# EAGLE design open-race-scale-pi-zero-board-v.01 (EAGLE 8.2.2)
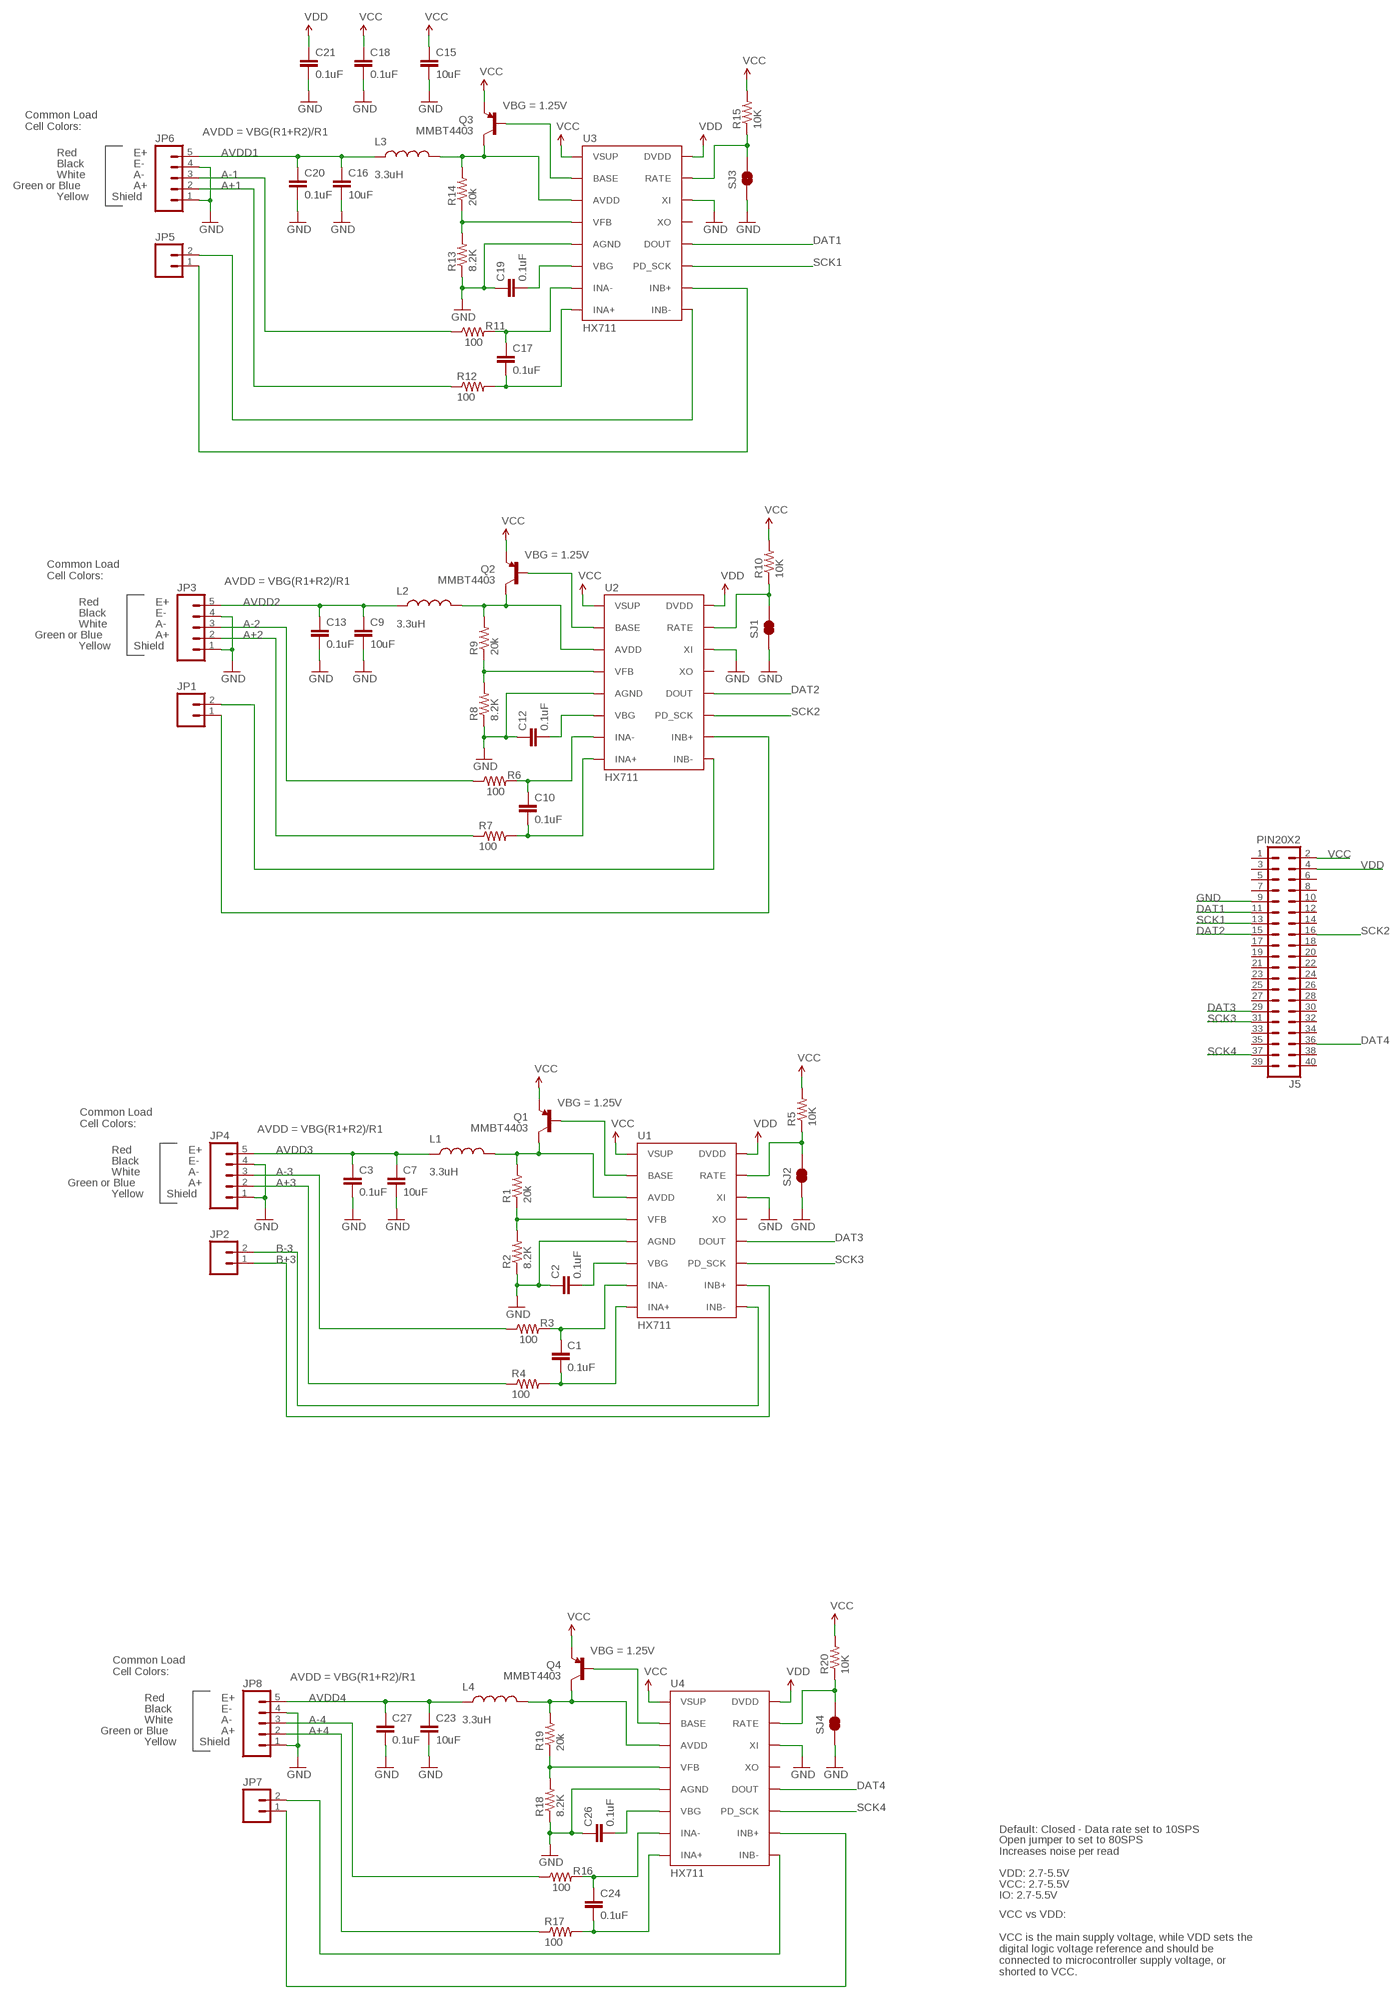
[diagram p0: schematic, sheet 1]

## Parts
C1  0.1uF  0.1UF-25V-5%(0603)  [0603-CAP]
C2  0.1uF  0.1UF-25V-5%(0603)  [0603-CAP]
C3  0.1uF  0.1UF-25V-5%(0603)  [0603-CAP]
C7  10uF  10UF50V20%(1210)  [1210]
C9  10uF  10UF50V20%(1210)  [1210]
C10  0.1uF  0.1UF-25V-5%(0603)  [0603-CAP]
C12  0.1uF  0.1UF-25V-5%(0603)  [0603-CAP]
C13  0.1uF  0.1UF-25V-5%(0603)  [0603-CAP]
C15  10uF  10UF50V20%(1210)  [1210]
C16  10uF  10UF50V20%(1210)  [1210]
C17  0.1uF  0.1UF-25V-5%(0603)  [0603-CAP]
C18  0.1uF  0.1UF-25V-5%(0603)  [0603-CAP]
C19  0.1uF  0.1UF-25V-5%(0603)  [0603-CAP]
C20  0.1uF  0.1UF-25V-5%(0603)  [0603-CAP]
C21  0.1uF  0.1UF-25V-5%(0603)  [0603-CAP]
C23  10uF  10UF50V20%(1210)  [1210]
C24  0.1uF  0.1UF-25V-5%(0603)  [0603-CAP]
C26  0.1uF  0.1UF-25V-5%(0603)  [0603-CAP]
C27  0.1uF  0.1UF-25V-5%(0603)  [0603-CAP]
J5  PIN20X2  [PIN_20X2]
JP1  M02PTH  [1X02]
JP2  M02PTH  [1X02]
JP3  M05PTH  [1X05]
JP4  M05PTH  [1X05]
JP5  M02PTH  [1X02]
JP6  M05PTH  [1X05]
JP7  M02PTH  [1X02]
JP8  M05PTH  [1X05]
L1  3.3uH  INDUCTOR0805-IND  [0805]
L2  3.3uH  INDUCTOR0805-IND  [0805]
L3  3.3uH  INDUCTOR0805-IND  [0805]
L4  3.3uH  INDUCTOR0805-IND  [0805]
Q1  MMBT4403  TRANSISTOR_PNPMMBT4403  [SOT23-3]
Q2  MMBT4403  TRANSISTOR_PNPMMBT4403  [SOT23-3]
Q3  MMBT4403  TRANSISTOR_PNPMMBT4403  [SOT23-3]
Q4  MMBT4403  TRANSISTOR_PNPMMBT4403  [SOT23-3]
R1  20k  20KOHM1/10W1%(0603)  [0603-RES]
R2  8.2K  8.2KOHM-1/10W-5%(0603)  [0603-RES]
R3  100  100OHM-1/10W-1%(0603)  [0603-RES]
R4  100  100OHM-1/10W-1%(0603)  [0603-RES]
R5  10K  10KOHM-1/10W-1%(0603)0603  [0603-RES]
R6  100  100OHM-1/10W-1%(0603)  [0603-RES]
R7  100  100OHM-1/10W-1%(0603)  [0603-RES]
R8  8.2K  8.2KOHM-1/10W-5%(0603)  [0603-RES]
R9  20k  20KOHM1/10W1%(0603)  [0603-RES]
R10  10K  10KOHM-1/10W-1%(0603)0603  [0603-RES]
R11  100  100OHM-1/10W-1%(0603)  [0603-RES]
R12  100  100OHM-1/10W-1%(0603)  [0603-RES]
R13  8.2K  8.2KOHM-1/10W-5%(0603)  [0603-RES]
R14  20k  20KOHM1/10W1%(0603)  [0603-RES]
R15  10K  10KOHM-1/10W-1%(0603)0603  [0603-RES]
R16  100  100OHM-1/10W-1%(0603)  [0603-RES]
R17  100  100OHM-1/10W-1%(0603)  [0603-RES]
R18  8.2K  8.2KOHM-1/10W-5%(0603)  [0603-RES]
R19  20k  20KOHM1/10W1%(0603)  [0603-RES]
R20  10K  10KOHM-1/10W-1%(0603)0603  [0603-RES]
SJ1  JUMPER-PAD-2-NC_BY_TRACE  [PAD-JUMPER-2-NC_BY_TRACE_YES_SILK]
SJ2  JUMPER-PAD-2-NC_BY_TRACE  [PAD-JUMPER-2-NC_BY_TRACE_YES_SILK]
SJ3  JUMPER-PAD-2-NC_BY_TRACE  [PAD-JUMPER-2-NC_BY_TRACE_YES_SILK]
SJ4  JUMPER-PAD-2-NC_BY_TRACE  [PAD-JUMPER-2-NC_BY_TRACE_YES_SILK]
U1  HX711  HX711HX711  [SO16]
U2  HX711  HX711HX711  [SO16]
U3  HX711  HX711HX711  [SO16]
U4  HX711  HX711HX711  [SO16]

## Nets
A+1: JP6.2 R12.1
A+2: JP3.2 R7.1
A+3: JP4.2 R4.1
A+4: JP8.2 R17.1
A-1: JP6.3 R11.1
A-2: JP3.3 R6.1
A-3: JP4.3 R3.1
A-4: JP8.3 R16.1
AVDD1: C16.1 C20.1 JP6.5 L3.1
AVDD2: C9.1 C13.1 JP3.5 L2.1
AVDD3: C3.1 C7.1 JP4.5 L1.1
AVDD4: C23.1 C27.1 JP8.5 L4.1
B+3: JP2.1 U1.10(INB+)
B-3: JP2.2 U1.9(INB-)
DAT1: J5.11 U3.12(DOUT)
DAT2: J5.15 U2.12(DOUT)
DAT3: J5.29 U1.12(DOUT)
DAT4: J5.36 U4.12(DOUT)
GND: C2.1 C3.2 C7.2 C9.2 C12.1 C13.2 C15.2 C16.2 C18.2 C19.1 C20.2 C21.2 C23.2 C26.1 C27.2 J5.9 JP3.1 JP3.4 JP4.1 JP4.4 JP6.1 JP6.4 JP8.1 JP8.4 R2.1 R8.1 R13.1 R18.1 SJ1.1 SJ2.1 SJ3.1 SJ4.1 U1.5(AGND) U1.14(XI) U2.5(AGND) U2.14(XI) U3.5(AGND) U3.14(XI) U4.5(AGND) U4.14(XI)
N$1: R5.1 SJ2.2 U1.15(RATE)
N$2: C1.1 R3.2 U1.7(INA-)
N$3: C1.2 R4.2 U1.8(INA+)
N$4: Q1.1(B) U1.2(BASE)
N$5: L1.2 Q1.3(C) R1.2 U1.3(AVDD)
N$6: R1.1 R2.2 U1.4(VFB)
N$7: C2.2 U1.6(VBG)
N$8: JP7.1 U4.10(INB+)
N$9: R8.2 R9.1 U2.4(VFB)
N$10: C12.2 U2.6(VBG)
N$11: JP5.1 U3.10(INB+)
N$12: JP5.2 U3.9(INB-)
N$13: JP7.2 U4.9(INB-)
N$14: JP1.1 U2.10(INB+)
N$15: JP1.2 U2.9(INB-)
N$20: C17.1 R11.2 U3.7(INA-)
N$21: C17.2 R12.2 U3.8(INA+)
N$22: Q4.1(B) U4.2(BASE)
N$23: R18.2 R19.1 U4.4(VFB)
N$24: C26.2 U4.6(VBG)
N$25: L4.2 Q4.3(C) R19.2 U4.3(AVDD)
N$26: R20.1 SJ4.2 U4.15(RATE)
N$27: C24.1 R16.2 U4.7(INA-)
N$28: C24.2 R17.2 U4.8(INA+)
N$82: Q2.1(B) U2.2(BASE)
N$112: L2.2 Q2.3(C) R9.2 U2.3(AVDD)
N$122: R10.1 SJ1.2 U2.15(RATE)
N$132: C10.1 R6.2 U2.7(INA-)
N$142: C10.2 R7.2 U2.8(INA+)
N$151: Q3.1(B) U3.2(BASE)
N$161: R13.2 R14.1 U3.4(VFB)
N$171: C19.2 U3.6(VBG)
N$182: L3.2 Q3.3(C) R14.2 U3.3(AVDD)
N$191: R15.1 SJ3.2 U3.15(RATE)
SCK1: J5.13 U3.11(PD_SCK)
SCK2: J5.16 U2.11(PD_SCK)
SCK3: J5.31 U1.11(PD_SCK)
SCK4: J5.37 U4.11(PD_SCK)
VCC: C15.1 C18.1 J5.2 Q1.2(E) Q2.2(E) Q3.2(E) Q4.2(E) R5.2 R10.2 R15.2 R20.2 U1.1(VSUP) U2.1(VSUP) U3.1(VSUP) U4.1(VSUP)
VDD: C21.1 J5.4 U1.16(DVDD) U2.16(DVDD) U3.16(DVDD) U4.16(DVDD)
Unconnected: J5.1 J5.3 J5.5 J5.6 J5.7 J5.8 J5.10 J5.12 J5.14 J5.17 J5.18 J5.19 J5.20 J5.21 J5.22 J5.23 J5.24 J5.25 J5.26 J5.27 J5.28 J5.30 J5.32 J5.33 J5.34 J5.35 J5.38 J5.39 J5.40 U1.13(XO) U2.13(XO) U3.13(XO) U4.13(XO)

## Notes on the sheet
- VBG = 1.25V
- Common Load
  Cell Colors:
- AVDD = VBG(R1+R2)/R1
- Red | E+
- Black | E-
- White | A-
- Green or Blue | A+
- Yellow | Shield
- VBG = 1.25V
- Common Load
  Cell Colors:
- AVDD = VBG(R1+R2)/R1
- Red | E+
- Black | E-
- White | A-
- Green or Blue | A+
- Yellow | Shield
- VBG = 1.25V
- Common Load
  Cell Colors:
- AVDD = VBG(R1+R2)/R1
- Red | E+
- Black | E-
- White | A-
- Green or Blue | A+
- Yellow | Shield
- VBG = 1.25V
- Common Load
  Cell Colors:
- AVDD = VBG(R1+R2)/R1
- Red | E+
- Black | E-
- White | A-
- Green or Blue | A+
- Yellow | Shield
- Default: Closed - Data rate set to 10SPS
- Open jumper to set to 80SPS
  Increases noise per read
- VDD: 2.7-5.5V
- VCC: 2.7-5.5V
- IO: 2.7-5.5V
- VCC vs VDD:
  
  VCC is the main supply voltage, while VDD sets the
  digital logic voltage reference and should be
  connected to microcontroller supply voltage, or
  shorted to VCC.

## Library data of the parts
C1-C3 C10 C12 C13 C17-C21 C24 C26 C27 = SparkFun-Capacitors:0.1UF-25V-5%(0603): CAP-08604; PROD_ID: CAP-08604
C7 C9 C15 C16 C23 = SparkFun-Capacitors:10UF50V20%(1210): CAP-09824; PROD_ID: CAP-09824
J5 = FLYFISH:PIN20X2
JP1 JP2 JP5 JP7 = SparkFun-Connectors:M02: Standard 2-pin 0.1" header. Use with - straight break away headers ( PRT-00116) - right angle break away headers (PRT-00553) - swiss pins (PRT-00743) - machine pins (PRT-00117) - female headers (PRT-00115) Molex polarized connector foot print use with: PRT-08233 with associated crimp pins and housings. 2.54_SCREWTERM for use with PRT-10571. 3.5mm Screw Terminal footprints for PRT-08084 5mm Screw Terminal footprints for use with PRT-08432
JP3 JP4 JP6 JP8 = SparkFun-Connectors:M05: Header 5 Standard 5-pin 0.1" header. Use with straight break away headers (SKU : PRT-00116), right angle break away headers (PRT-00553), swiss pins (PRT-00743), machine pins (PRT-00117), and female headers (PRT-00115). Molex polarized connector foot print use with SKU : PRT-08230 with associated crimp pins and housings.
L1-L4 = SparkFun-Passives:INDUCTOR: Inductors Basic Inductor/Choke - 0603 and 1206. Footprints are not proven and vary greatly between part numbers. INDUCTOR POWER 3.3UH 4.0A SMD 0.197" L x 0.197" W x 0.177" H (5.00mm x 5.00mm x 4.50mm); PROD_ID: NDUC-13076
Q1-Q4 = SparkFun-DiscreteSemi:TRANSISTOR_PNP: Generic PNP BJT Double check pinouts against datasheets- not all devices are the same! MMBT3906 - 40V 200mA SOT-23 (TRANS-08052) MMBT4403 - 40V 600mA SOT-23 (TRANS-09245); PROD_ID: TRANS-09245
R1 R9 R14 R19 = SparkFun-Resistors:20KOHM1/10W1%(0603): RES-09383; PROD_ID: RES-09383
R2 R8 R13 R18 = SparkFun-Resistors:8.2KOHM-1/10W-5%(0603): RES-10646; PROD_ID: RES-10646
R3 R4 R6 R7 R11 R12 R16 R17 = SparkFun-Resistors:100OHM-1/10W-1%(0603): RES-07863; PROD_ID: RES-07863
R5 R10 R15 R20 = SparkFun-Resistors:10KOHM-1/10W-1%(0603): RES-00824; PROD_ID: RES-00824
SJ1-SJ4 = SparkFun-Passives:JUMPER-PAD-2-NC_BY_TRACE
U1-U4 = Testing:HX711; PROD_ID: IC-12445

## Board
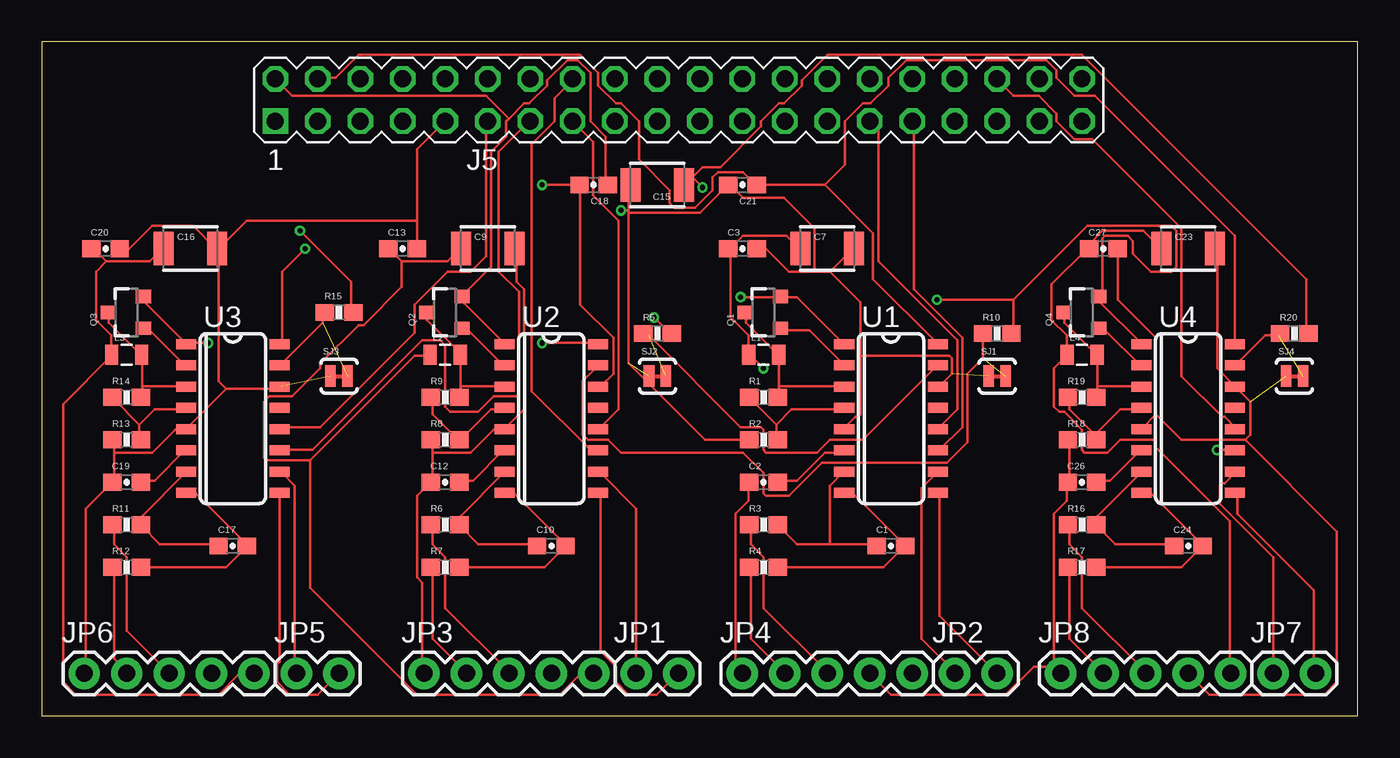
[diagram p1: board, top side]
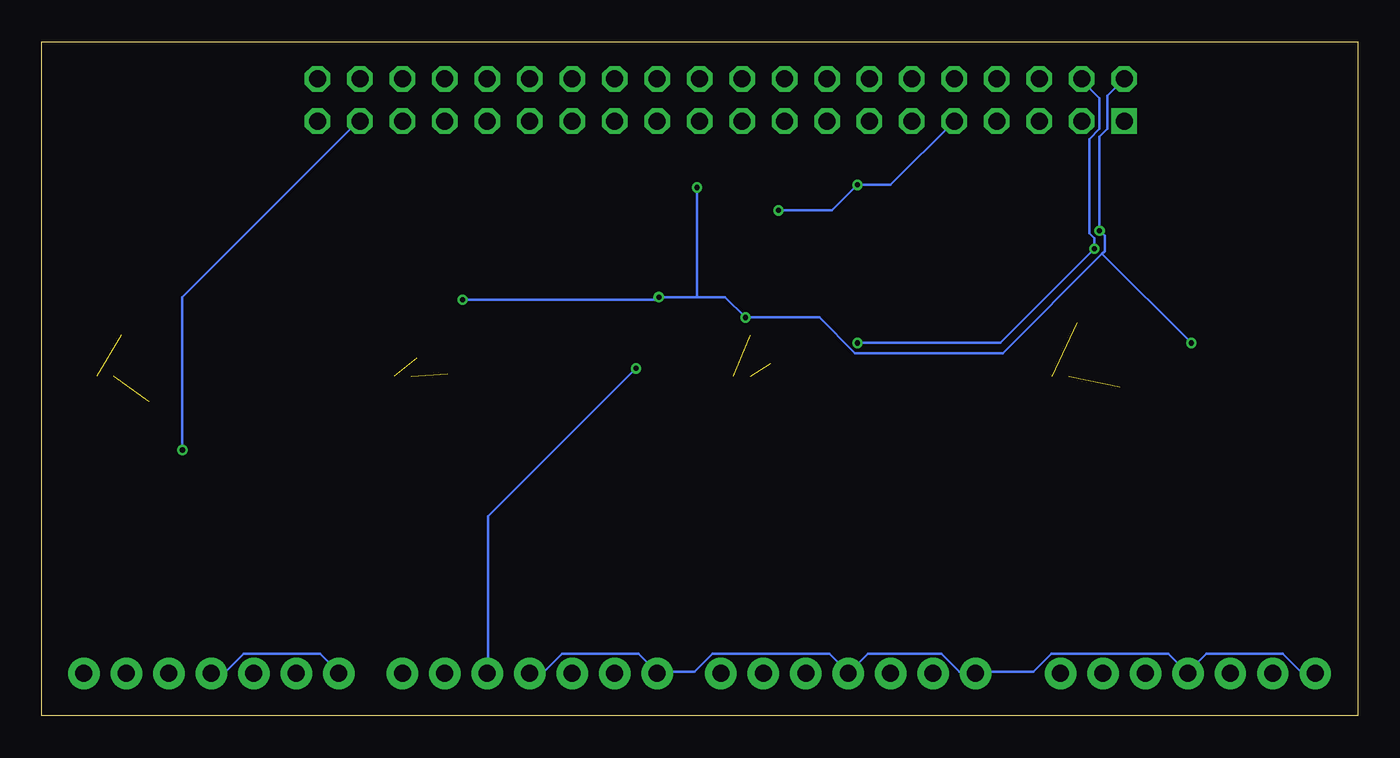
[diagram p2: board, bottom side, seen from below]

Size 78.72 x 40.31 mm. Coordinates in mm from the lower left corner, seen from the top.
Outline: 0,0 78.72,0 78.72,40.31 0,40.31 0,0
Copper layers (1*16): Top 0.035mm / dielectric 1.5mm / Bottom 0.035mm
Design rules "SeeedStudio_2layer_DRU_no_angle_20140221": minimum track width 6mil, minimum drill 12mil, track to track 6mil, track to pad 6mil, pad to pad 6mil, via to via 6mil, smd to smd 0mil, copper to edge 10mil, drill to drill 10mil, minimum pad ring 10mil, minimum via ring 6mil, stop-mask expansion 2mil, vias tented up to drill 100mil, thermal gap 10mil

### Footprints (pad centres in the part's own frame; a part is rotated, then mirrored left to right if it is on the bottom)
0603-CAP = smd 1.1 x 1: 1 -0.85,0; 2 0.85,0
1210 = smd 1.2 x 2: 1 -1.6,0; 2 1.6,0
PIN_20X2 = drill 1.016 square: 1 -24.13,-1.27 | drill 1.016 octagon: 2 -24.13,1.27; 3 -21.59,-1.27; 4 -21.59,1.27; 5 -19.05,-1.27; 6 -19.05,1.27; 7 -16.51,-1.27; 8 -16.51,1.27; 9 -13.97,-1.27; 10 -13.97,1.27; 11 -11.43,-1.27; 12 -11.43,1.27; 13 -8.89,-1.27; 14 -8.89,1.27; 15 -6.35,-1.27; 16 -6.35,1.27; 17 -3.81,-1.27; 18 -3.81,1.27; 19 -1.27,-1.27; 20 -1.27,1.27; 21 1.27,-1.27; 22 1.27,1.27; 23 3.81,-1.27; 24 3.81,1.27; 25 6.35,-1.27; 26 6.35,1.27; 27 8.89,-1.27; 28 8.89,1.27; 29 11.43,-1.27; 30 11.43,1.27; 31 13.97,-1.27; 32 13.97,1.27; 33 16.51,-1.27; 34 16.51,1.27; 35 19.05,-1.27; 36 19.05,1.27; 37 21.59,-1.27; 38 21.59,1.27; 39 24.13,-1.27; 40 24.13,1.27
1X02 = drill 1.016 pad 1.88: 1 0,0; 2 2.54,0
1X05 = drill 1.016 pad 1.88: 1 0,0; 2 2.54,0; 3 5.08,0; 4 7.62,0; 5 10.16,0
0805 = smd 0.8 x 1.2: 1 -0.9,0; 2 0.9,0
SOT23-3 = smd 0.8 x 0.9: 1 -0.95,-1; 2 0.95,-1; 3 0,1.1
0603-RES = smd 1.1 x 1: 1 -0.85,0; 2 0.85,0
PAD-JUMPER-2-NC_BY_TRACE_YES_SILK = smd 0.635 x 1.27: 1 -0.508,0; 2 0.508,0
SO16 = smd 0.6 x 1.2: 1 -4.445,-2.8; 2 -3.175,-2.8; 3 -1.905,-2.8; 4 -0.635,-2.8; 5 0.635,-2.8; 6 1.905,-2.8; 7 3.175,-2.8; 8 4.445,-2.8; 9 4.445,2.8; 10 3.175,2.8; 11 1.905,2.8; 12 0.635,2.8; 13 -0.635,2.8; 14 -1.905,2.8; 15 -3.175,2.8; 16 -4.445,2.8

### Placement (x,y rotation side)
C1  50.8,10.16 0 top
C2  43.18,13.97 0 top
C3  41.91,27.94 0 top
C7  46.99,27.94 0 top
C9  26.67,27.94 0 top
C10  30.48,10.16 0 top
C12  24.13,13.97 0 top
C13  21.59,27.94 0 top
C15  36.83,31.75 180 top
C16  8.89,27.94 0 top
C17  11.43,10.16 0 top
C18  33.02,31.75 180 top
C19  5.08,13.97 0 top
C20  3.81,27.94 0 top
C21  41.91,31.75 180 top
C23  68.58,27.94 0 top
C24  68.58,10.16 0 top
C26  62.23,13.97 0 top
C27  63.5,27.94 0 top
J5  38.1,36.83 0 top
JP1  35.56,2.54 0 top
JP2  54.61,2.54 0 top
JP3  22.86,2.54 0 top
JP4  41.91,2.54 0 top
JP5  15.24,2.54 0 top
JP6  2.54,2.54 0 top
JP7  73.66,2.54 0 top
JP8  60.96,2.54 0 top
L1  43.18,21.59 0 top
L2  24.13,21.59 0 top
L3  5.08,21.59 0 top
L4  62.23,21.59 0 top
Q1  43.18,24.13 90 top
Q2  24.13,24.13 90 top
Q3  5.08,24.13 90 top
Q4  62.23,24.13 90 top
R1  43.18,19.05 0 top
R2  43.18,16.51 0 top
R3  43.18,11.43 0 top
R4  43.18,8.89 0 top
R5  36.83,22.86 0 top
R6  24.13,11.43 0 top
R7  24.13,8.89 0 top
R8  24.13,16.51 0 top
R9  24.13,19.05 0 top
R10  57.15,22.86 0 top
R11  5.08,11.43 0 top
R12  5.08,8.89 0 top
R13  5.08,16.51 0 top
R14  5.08,19.05 0 top
R15  17.78,24.13 0 top
R16  62.23,11.43 0 top
R17  62.23,8.89 0 top
R18  62.23,16.51 0 top
R19  62.23,19.05 0 top
R20  74.93,22.86 0 top
SJ1  57.15,20.32 0 top
SJ2  36.83,20.32 0 top
SJ3  17.78,20.32 0 top
SJ4  74.93,20.32 0 top
U1  50.8,17.78 270 top
U2  30.48,17.78 270 top
U3  11.43,17.78 270 top
U4  68.58,17.78 270 top

### Tracks (layer width: path | path; a pad name or v marks a point on that pad's centre or on a via)
A+1
  Top 0.152: R12.1 4.32,8.89 4.32,3.4 5.08,2.64 JP6.2
A+2
  Top 0.152: R7.1 23.37,8.89 23.37,4.62 25.35,2.64 JP3.2
A+3
  Top 0.152: R4.1 42.42,8.89 42.42,4.62 44.4,2.64 JP4.2
A+4
  Top 0.152: R17.1 61.47,8.89 61.47,4.62 63.45,2.64 JP8.2
A-1
  Top 0.152: JP6.3 5.08,5.08 5.08,9.5 4.32,10.26 4.32,11.33 R11.1
A-2
  Top 0.152: R6.1 23.37,11.33 23.37,10.26 24.13,9.5 24.13,6.45 27.94,2.64 JP3.3
A-3
  Top 0.152: R3.1 42.42,11.33 42.42,10.26 43.18,9.5 43.18,6.45 46.99,2.64 JP4.3
A-4
  Top 0.152: R16.1 61.47,11.33 61.47,10.26 62.23,9.5 62.23,6.45 66.04,2.64 JP8.3
AVDD1
  Top 0.152: 3.86,27.18 3.1,27.94 C20.1 | 3.86,27.18 6.45,27.18 7.21,27.94 C16.1 | 3.86,27.18 3.25,26.57 3.25,23.67 4.17,22.76 4.17,21.69 L3.1 4.17,21.54 1.27,18.64 1.27,2.03 2.03,1.27 10.57,1.27 11.79,2.49 12.7,2.49 JP6.5
AVDD2
  Top 0.152: 21.54,27.18 20.78,27.94 C13.1 | 21.54,27.18 24.28,27.18 25.04,27.94 C9.1 | 16.05,15.29 22.3,21.54 23.22,21.54 L2.1 | 16.05,15.29 13.46,15.29 13.31,15.44 13.31,18.8 13.61,19.1 14.99,19.1 16.66,20.78 16.66,21.08 18.95,23.37 19.25,23.37 21.54,25.65 21.54,27.18 | 16.05,15.29 16.05,7.67 22.45,1.27 30.99,1.27 32.21,2.49 32.97,2.49 JP3.5
AVDD3  (via drill 0.3)
  Top 0.152: 41.2,27.94 41.96,28.7 44.55,28.7 45.31,27.94 C7.1 | 41.2,27.94 41.2,23.83 42.27,22.76 42.27,21.69 L1.1 42.42,21.54 v43.18,20.78 | 41.2,27.94 C3.1
  Bottom 0.152: v43.18,20.78 52.02,11.94 52.02,2.64 JP4.5
AVDD4
  Top 0.152: C23.1 66.95,27.94 65.89,29.01 63.45,29.01 62.69,28.24 62.69,27.94 C27.1 62.54,27.94 60.4,25.81 60.4,23.67 61.32,22.76 61.32,21.69 L4.1 61.32,21.54 60.55,20.78 60.55,18.49 60.86,18.19 61.16,18.19 62.23,17.12 62.23,15.9 62.38,15.75 63.75,15.75 64.52,16.51 66.5,16.51 66.65,16.36 66.65,16.05 71.07,11.63 71.07,2.64 JP8.5
B+3
  Top 0.152: U1.10 53.54,14.53 52.63,13.61 52.63,4.62 54.61,2.64 JP2.1
B-3
  Top 0.152: JP2.2 53.7,5.99 53.7,13.31 U1.9
DAT1
  Top 0.152: U3.12 14.38,17.27 16.66,17.27 22.3,22.91 22.3,24.59 24.28,26.57 25.65,26.57 26.57,27.48 26.57,35.56 J5.11
DAT2
  Top 0.152: J5.15 32.97,34.34 32.97,31.14 34.49,29.62 34.49,18.34 33.43,17.27 U2.12
DAT3
  Top 0.152: U1.12 53.7,17.27 54.76,18.34 54.76,22.45 50.04,27.18 50.04,35.1 49.58,35.56 J5.29
DAT4
  Top 0.152: U4.12 71.37,17.27 70.76,17.88 70.61,17.88 68.17,20.32 68.17,29.16 62.84,34.49 61.77,34.49 60.71,35.56 60.71,36.02 59.64,37.08 58.12,37.08 57.2,38 J5.36
GND  (via drill 0.3)  (4 unrouted)
  Top 0.152: C23.2 70.31,27.94 70.31,20.78 71.37,19.71 U4.14 71.53,19.56 72.29,18.8 72.29,16.81 71.98,16.51 | 66.65,18.03 66.65,22.61 64.36,24.89 64.36,27.94 C27.2 | 66.65,18.03 65.89,17.27 U4.5 | 71.98,16.51 68.17,16.51 66.65,18.03 | R18.1 61.47,16.51 61.47,14.07 C26.1 61.32,13.92 61.32,12.85 60.55,12.09 60.55,2.95 | 60.55,2.95 JP8.1 60.86,2.64 | 71.98,16.51 77.47,11.02 77.47,2.03 76.71,1.27 69.85,1.27 JP8.4 | JP4.1 41.5,2.95 41.5,12.09 42.27,12.85 42.27,13.92 C2.1 | 23.37,15.75 23.37,16.51 R8.1 | 23.37,15.75 23.37,14.07 C12.1 23.22,13.92 22.45,13.16 22.45,8.28 22.76,7.98 22.76,2.64 JP3.1 | 23.37,15.75 25.65,15.75 27.03,17.12 27.64,17.12 U2.5 27.79,17.27 28.85,18.34 28.85,25.5 28.4,25.96 28.4,27.94 C9.2 | 60.55,2.95 59.33,2.95 57.66,1.27 50.8,1.27 JP4.4 | C3.2 43.33,27.94 44.7,26.57 46.23,26.57 | 47.14,26.57 46.23,26.57 | 47.14,26.57 48.51,27.94 C7.2 | 48.97,21.54 48.97,24.74 47.14,26.57 | 48.97,21.54 48.97,18.03 48.82,17.88 48.67,17.88 48.06,17.27 U1.5 | 48.97,21.54 54.3,21.54 54.46,21.39 54.46,20.47 53.7,19.71 U1.14 | R2.1 39.68,16.51 35.1,21.08 35.1,30.07 | 35.1,30.23 35.1,31.75 C15.2 | 35.1,30.23 35.1,30.07 | 35.1,30.07 39.37,30.07 41.05,31.75 C21.2 41.2,31.75 41.96,30.99 44.4,30.99 46.23,29.16 46.23,26.57 | U2.14 33.43,19.71 34.19,20.47 34.19,22.61 32.21,24.59 32.21,31.75 C18.2 v29.92,31.75 | 22.45,29.62 22.45,33.88 J5.9 | 22.45,29.62 22.45,27.94 C13.2 | C20.2 5.23,27.94 6.6,29.31 9.04,29.31 10.41,27.94 C16.2 10.57,27.94 | 4.32,15.75 4.32,16.51 R13.1 | 4.32,15.75 4.32,14.07 C19.1 4.17,13.92 2.64,12.39 2.64,2.64 JP6.1 | 4.32,15.75 6.6,15.75 7.98,17.12 8.59,17.12 U3.5 8.74,17.27 11.02,19.56
  Top 0.152: 11.02,19.56 14.22,19.56 U3.14 | 10.57,27.94 10.57,20.02 11.02,19.56 | 22.45,29.62 12.24,29.62 10.57,27.94 | v34.65,30.23 35.1,30.23
  Bottom 0.152: JP8.4 68.48,2.64 67.72,2.64 66.65,3.71 62.08,3.71 61.01,2.64 JP8.1 | JP4.4 49.43,2.64 48.67,2.64 47.6,3.71 43.03,3.71 41.96,2.64 JP4.1 41.81,2.64 39.68,2.64 38.61,3.71 31.6,3.71 30.53,2.64 JP3.4 29.31,3.71 24.89,3.71 23.82,2.64 22.91,2.64 JP3.1 22.76,2.64 19.41,2.64 18.34,3.71 11.33,3.71 JP6.4 10.11,2.64 9.04,3.71 4.47,3.71 3.4,2.64 2.64,2.64 JP6.1 | J5.9 27.94,31.75 v29.92,31.75 31.45,30.23 v34.65,30.23
N$1  (1 unrouted)
  Top 0.152: R5.1 36.02,22.76 36.32,22.76 41.81,17.27 43.03,17.27 43.18,17.12 43.18,15.9 43.33,15.75 46.38,15.75 47.14,16.51 49.12,16.51 53.54,20.93 U1.15
N$2
  Top 0.152: 47.14,10.26 45.16,10.26 44.09,11.33 R3.2 | 47.14,10.26 49.89,10.26 C1.1 | 47.14,10.26 47.14,13.77 47.9,14.53 U1.7
N$3
  Top 0.152: R4.2 50.34,8.89 51.56,10.11 C1.2 51.56,10.26 48.51,13.31 48.06,13.31 U1.8
N$4
  Top 0.152: Q1.1 44.25,23.06 45.92,23.06 47.9,21.08 U1.2
N$5
  Top 0.152: Q1.3 42.11,24.13 42.11,23.52 43.94,21.69 L1.2 44.09,21.54 44.09,19.71 | 44.09,19.71 44.09,19.1 R1.2 | 44.09,19.71 47.9,19.71 U1.3
N$6
  Top 0.152: 43.94,17.42 43.94,16.51 R2.2 | 43.94,17.42 42.42,18.95 R1.1 | 43.94,17.42 44.86,18.34 47.9,18.34 U1.4
N$7
  Top 0.152: C2.2 44.09,14.07 45.16,14.07 46.84,15.75 47.9,15.75 U1.6
N$8
  Top 0.152: JP7.1 73.66,9.5 70.46,12.7 70.46,13.77 70.61,13.92 70.76,13.92 71.37,14.53 U4.10
N$9
  Top 0.152: R9.1 23.37,18.95 23.37,18.03 24.89,16.51 R8.2 25.04,16.51 26.87,18.34 27.64,18.34 U2.4
N$10
  Top 0.152: C12.2 25.04,14.07 25.81,14.07 27.64,15.9 U2.6
N$11
  Top 0.152: U3.10 14.38,14.53 15.14,13.77 15.14,2.64 JP5.1
N$12
  Top 0.152: JP5.2 16.51,1.27 14.83,1.27 14.07,2.03 14.07,3.1 14.22,3.25 14.22,13.31 U3.9
N$13
  Top 0.152: U4.9 71.53,13.31 71.53,12.09 76.1,7.52 76.1,2.64 JP7.2
N$14
  Top 0.152: JP1.1 35.56,12.39 33.43,14.53 U2.10
N$15
  Top 0.152: U2.9 33.43,13.31 33.43,3.86 34.34,2.95 34.34,2.03 35.1,1.27 36.78,1.27 38,2.49 JP1.2
N$20
  Top 0.152: C17.1 10.57,10.26 7.06,10.26 5.99,11.33 R11.2 5.99,11.48 5.99,11.94 8.59,14.53 U3.7
N$21
  Top 0.152: R12.2 11.02,8.89 12.24,10.11 C17.2 12.24,10.26 9.2,13.31 8.74,13.31 U3.8
N$22
  Top 0.152: Q4.1 63.3,23.06 63.6,23.06 65.73,20.93 U4.2
N$23
  Top 0.152: 62.99,16.81 61.47,18.34 61.47,18.95 R19.1 | 62.99,16.81 62.99,16.51 R18.2 62.99,16.81 | 62.99,16.81 64.52,18.34 65.73,18.34 U4.4
N$24
  Top 0.152: C26.2 63.14,14.07 63.91,14.07 65.73,15.9 U4.6
N$25
  Top 0.152: Q4.3 61.16,24.13 61.16,23.52 62.99,21.69 L4.2 63.14,21.54 63.14,19.71 | 63.14,19.71 63.14,19.1 R19.2 | 63.14,19.71 65.73,19.71 U4.3
N$26  (1 unrouted)
  Top 0.152: R20.1 73.96,22.76 73.2,22.76 71.53,21.08 U4.15
N$27
  Top 0.152: C24.1 67.72,10.26 64.21,10.26 63.14,11.33 R16.2 63.14,11.48 63.14,11.94 65.73,14.53 U4.7
N$28
  Top 0.152: R17.2 68.17,8.89 69.39,10.11 C24.2 69.39,10.26 66.34,13.31 65.89,13.31 U4.8
N$82
  Top 0.152: Q2.1 25.2,23.06 25.5,23.06 27.64,20.93 U2.2
N$112
  Top 0.152: Q2.3 23.06,24.13 23.06,23.67 25.04,21.69 L2.2 25.04,21.54 25.04,19.71 | 25.04,19.71 25.04,19.1 R9.2 | 25.04,19.71 27.64,19.71 U2.3
N$122  (1 unrouted)
  Top 0.152: R10.1 56.29,22.76 56.29,21.39 55.37,20.47 55.37,16.36 54.15,15.14 46.69,15.14 44.7,13.16 43.33,13.16 43.18,13.31 43.18,14.53 41.96,15.75 34.65,15.75 33.88,16.51 32.66,16.51 32.36,16.81 32.36,20.02 33.27,20.93 U2.15
N$132
  Top 0.152: C10.1 29.62,10.26 26.11,10.26 25.04,11.33 R6.2 25.04,11.48 25.04,11.94 27.64,14.53 U2.7
N$142
  Top 0.152: R7.2 30.07,8.89 31.29,10.11 C10.2 31.29,10.26 28.25,13.31 27.79,13.31 U2.8
N$151
  Top 0.152: Q3.1 6.15,23.06 6.45,23.06 8.59,20.93 U3.2
N$161
  Top 0.152: 5.84,17.42 5.84,16.51 R13.2 | 5.84,17.42 4.32,18.95 R14.1 | 5.84,17.42 6.76,18.34 8.59,18.34 U3.4
N$171
  Top 0.152: C19.2 5.99,14.07 6.76,14.07 8.59,15.9 U3.6
N$182
  Top 0.152: Q3.3 4.01,24.13 4.01,23.52 5.84,21.69 L3.2 5.99,21.54 5.99,19.71 | 5.99,19.71 5.99,19.1 R14.2 | 5.99,19.71 8.59,19.71 U3.3
N$191  (1 unrouted)
  Top 0.152: R15.1 16.82,24.13 16.82,23.52 14.38,21.08 U3.15
SCK1
  Top 0.152: U3.11 14.38,15.9 16.21,15.9 22.76,22.45 23.82,22.45 24.13,22.15 24.13,18.49 24.44,18.19 26.11,18.19 27.03,19.1 28.4,19.1 28.55,19.25 28.55,25.35 27.33,26.57 27.33,33.73 29.16,35.56 J5.13
SCK2
  Top 0.152: U2.11 33.27,15.9 32.82,15.9 29.31,19.41 29.31,34.19 30.68,35.56 30.68,36.93 31.75,38 J5.16
SCK3
  Top 0.152: U1.11 53.7,15.9 55.07,17.27 55.07,22.61 52.17,25.5 52.17,35.56 J5.31
SCK4  (via drill 0.3)
  Top 0.152: v70.31,15.9 71.37,15.9 U4.11
  Bottom 0.152: v70.31,15.9 70.31,25.04 59.79,35.56 J5.37
VCC  (via drill 0.3)
  Top 0.152: 38.91,32.21 38.46,31.75 C15.1 38.91,32.21 | 38.91,32.21 39.52,32.82 40.59,32.82 43.03,35.25 43.03,35.56 44.09,36.63 44.4,36.63 45.47,37.69 45.47,38 46.99,39.52 62.23,39.52 75.64,26.11 75.64,22.91 R20.2 | U2.1 27.64,22.3 25.2,24.74 25.2,25.04 Q2.2 25.2,25.2 26.87,26.87 26.87,33.73 27.79,34.65 27.79,35.56 27.94,35.71 | 27.94,35.71 28.85,36.63 29.16,36.63 30.23,37.69 30.23,38 31.45,39.22 32.05,39.22 32.82,38.46 32.82,35.56 33.73,34.65 33.73,31.75 C18.1 | U4.1 65.73,22.3 63.3,24.74 63.3,25.04 Q4.2 63.3,25.2 63.45,25.35 63.45,28.55 63.6,28.7 64.97,28.7 65.28,28.4 65.28,27.63 66.34,26.57 67.56,26.57 67.87,26.87 67.87,29.01 67.56,29.31 62.54,29.31 58.12,24.89 | 58.12,24.89 58.12,22.91 R10.2 | U1.1 47.9,22.3 45.16,25.04 44.25,25.04 Q1.2 44.09,25.04 v41.81,25.04 | Q3.2 6.15,25.04 6.15,24.74 8.59,22.3 U3.1 8.74,22.3 v9.96,22.3 | v15.44,29.01 18.49,25.96 18.49,24.13 R15.2 | v36.63,23.83 37.54,22.91 R5.2 | v53.54,24.89 58.12,24.89 | 27.94,35.71 26.57,37.08 14.99,37.08 J5.2 | v39.52,31.6 38.91,32.21
  Bottom 0.152: J5.2 14.99,37.08 14.99,35.1 15.44,34.65 v15.44,29.01 15.14,28.7 15.14,27.79 15.29,27.63 | 15.29,27.63 21.23,21.69 30.07,21.69 32.21,23.83 v36.63,23.83 37.85,25.04 39.52,25.04 | 15.29,27.63 v9.96,22.3 | 39.52,25.04 v41.81,25.04 41.96,24.89 v53.54,24.89 | 39.52,25.04 v39.52,31.6
VDD  (via drill 0.3)
  Top 0.152: v15.75,27.94 14.38,26.57 14.38,22.3 U3.16 | v29.92,22.3 33.27,22.3 U2.16 | 46.84,31.75 C21.1 42.72,31.75 41.96,32.51 40.44,32.51 40.13,32.21 40.13,31.44 39.06,30.38 37.85,30.38 37.54,30.68 37.54,31.44 35.71,33.27 35.71,35.56 34.65,36.63 34.34,36.63 33.27,37.69 33.27,38.46 32.21,39.52 18.95,39.52 17.58,38.15 16.51,38.15 J5.4 | 46.84,31.75 49.73,28.85 49.73,26.11 53.54,22.3 U1.16 | 46.84,31.75 48.06,32.97 48.06,35.56 49.12,36.63 49.58,36.63 50.65,37.69 50.65,38.15 51.71,39.22 60.1,39.22 60.71,38.61 60.71,38.15 61.77,37.08 62.99,37.08 71.37,28.7 71.37,22.3 U4.16
  Bottom 0.152: J5.4 16.51,38 15.44,36.93 15.44,35.1 16.05,34.49 16.05,28.85 15.75,28.55 v15.75,27.94 21.39,22.3 v29.92,22.3